# EAGLE schematic core (EAGLE 7.1.0)
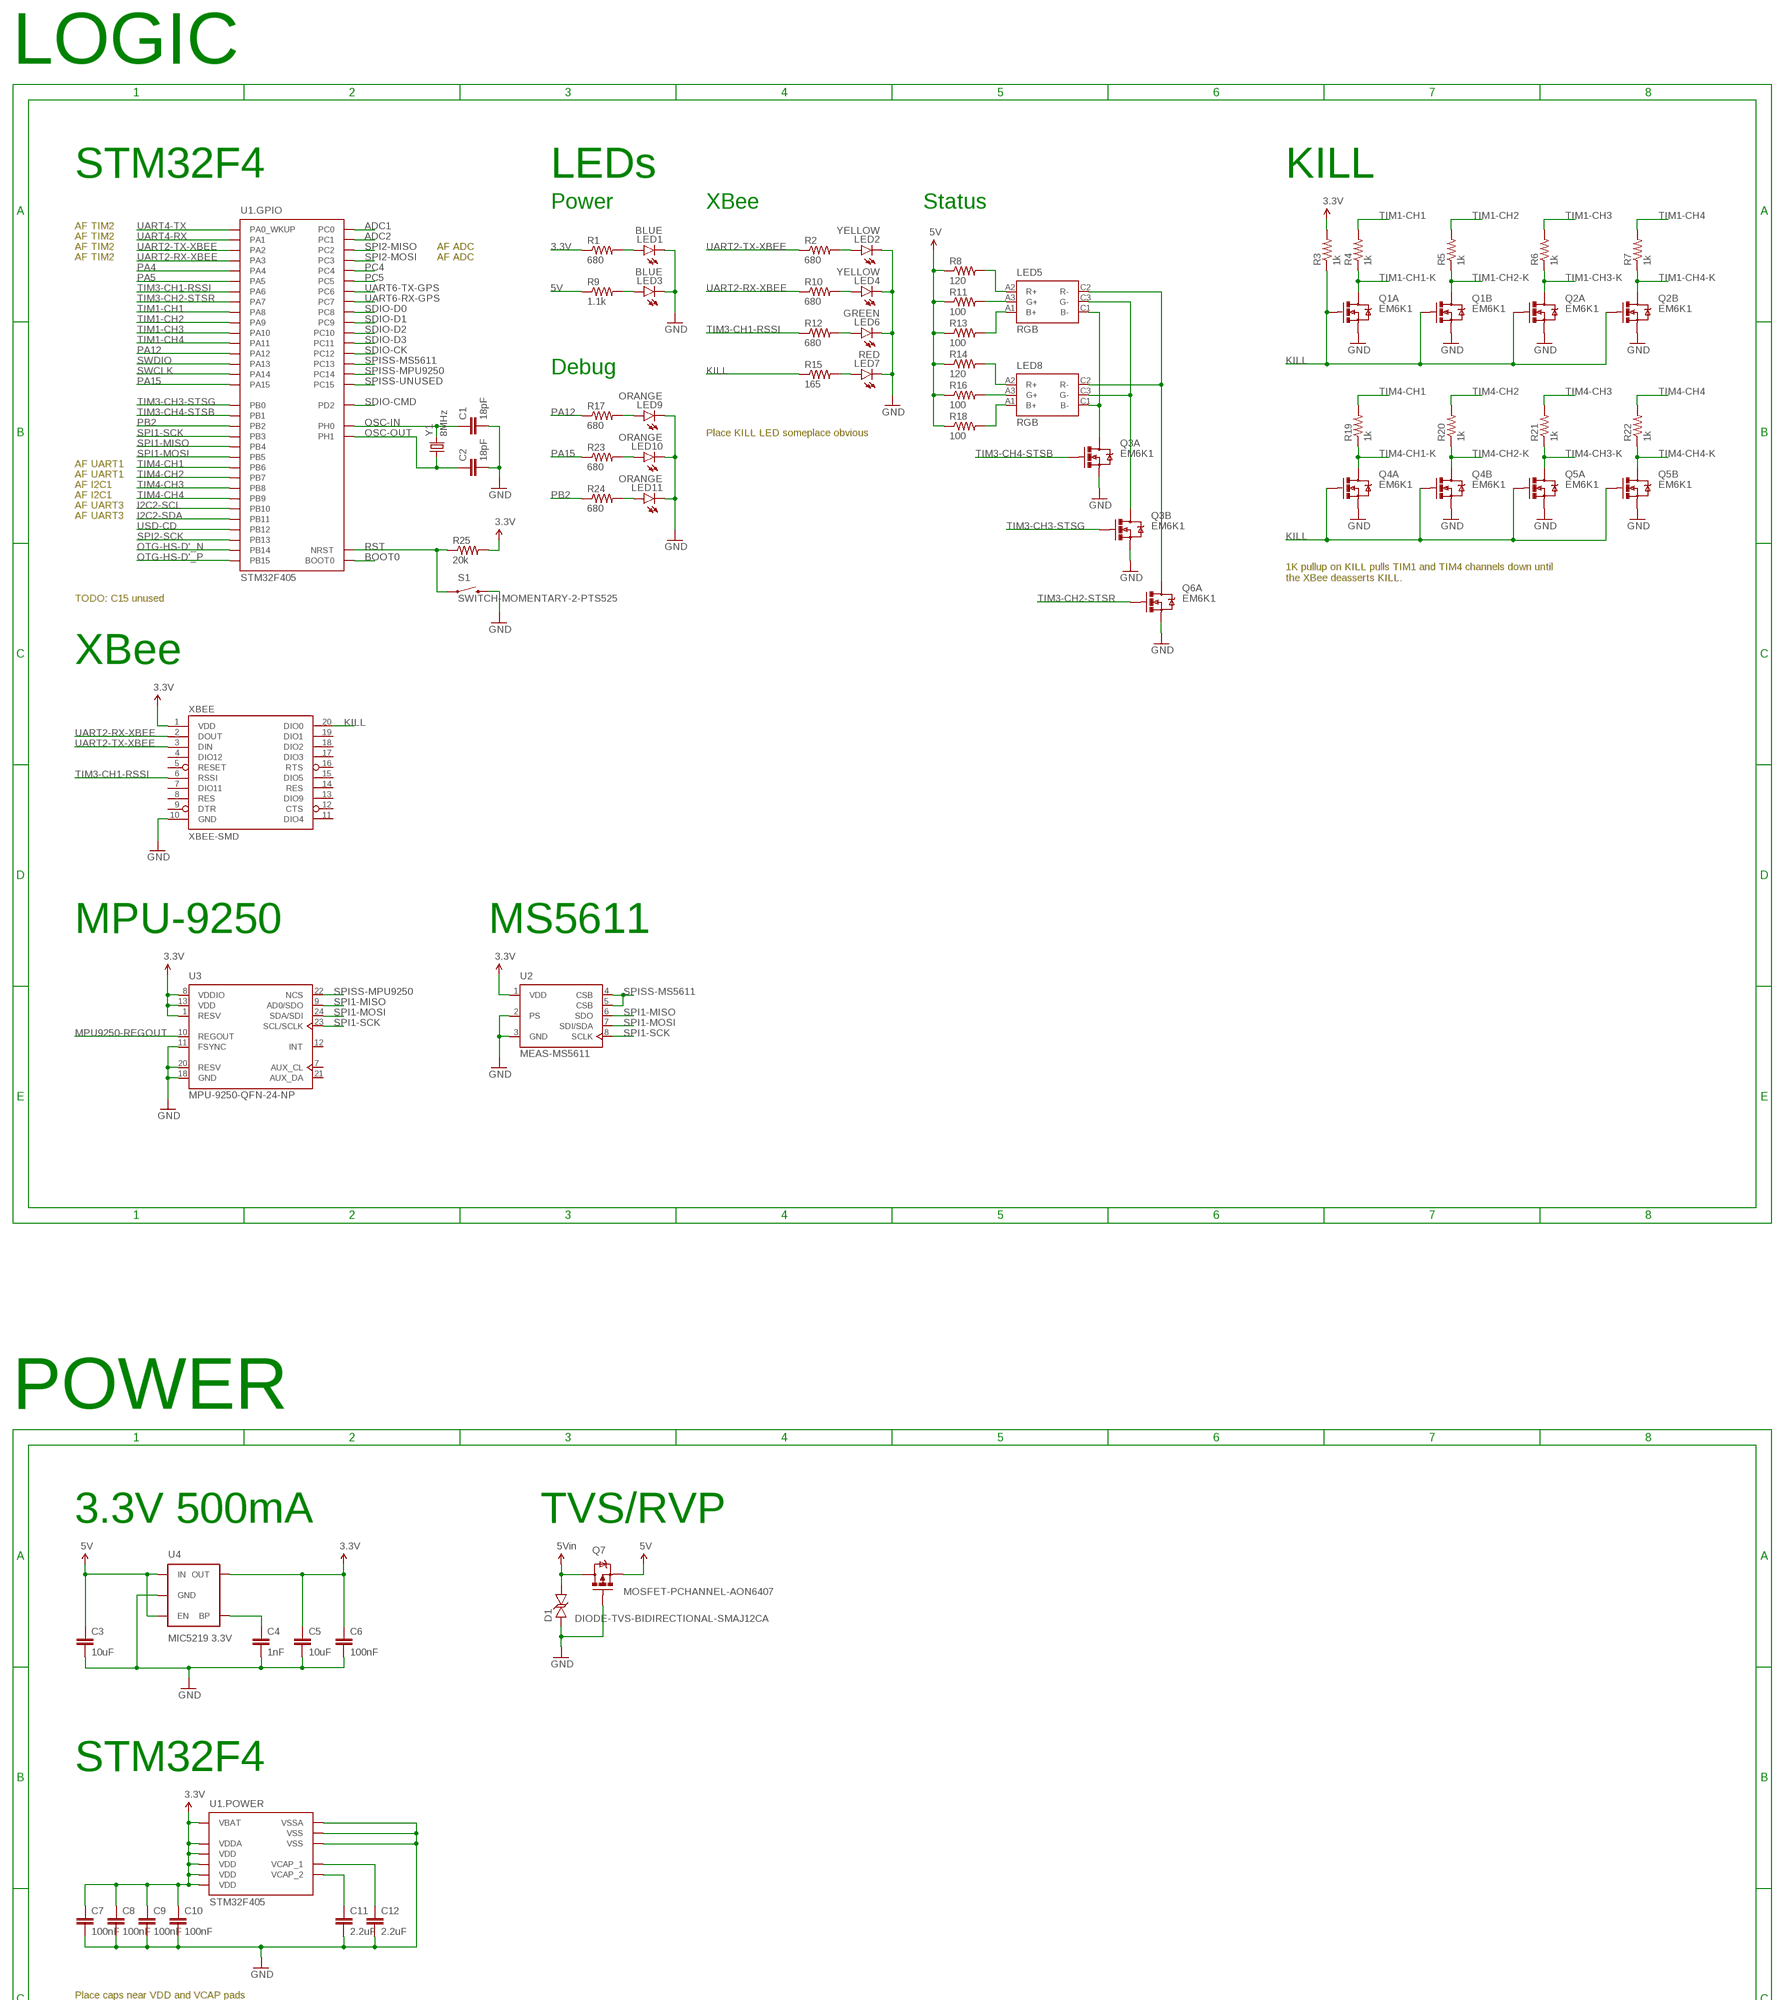
[diagram p0: schematic, sheet 1, part 1 of 2]
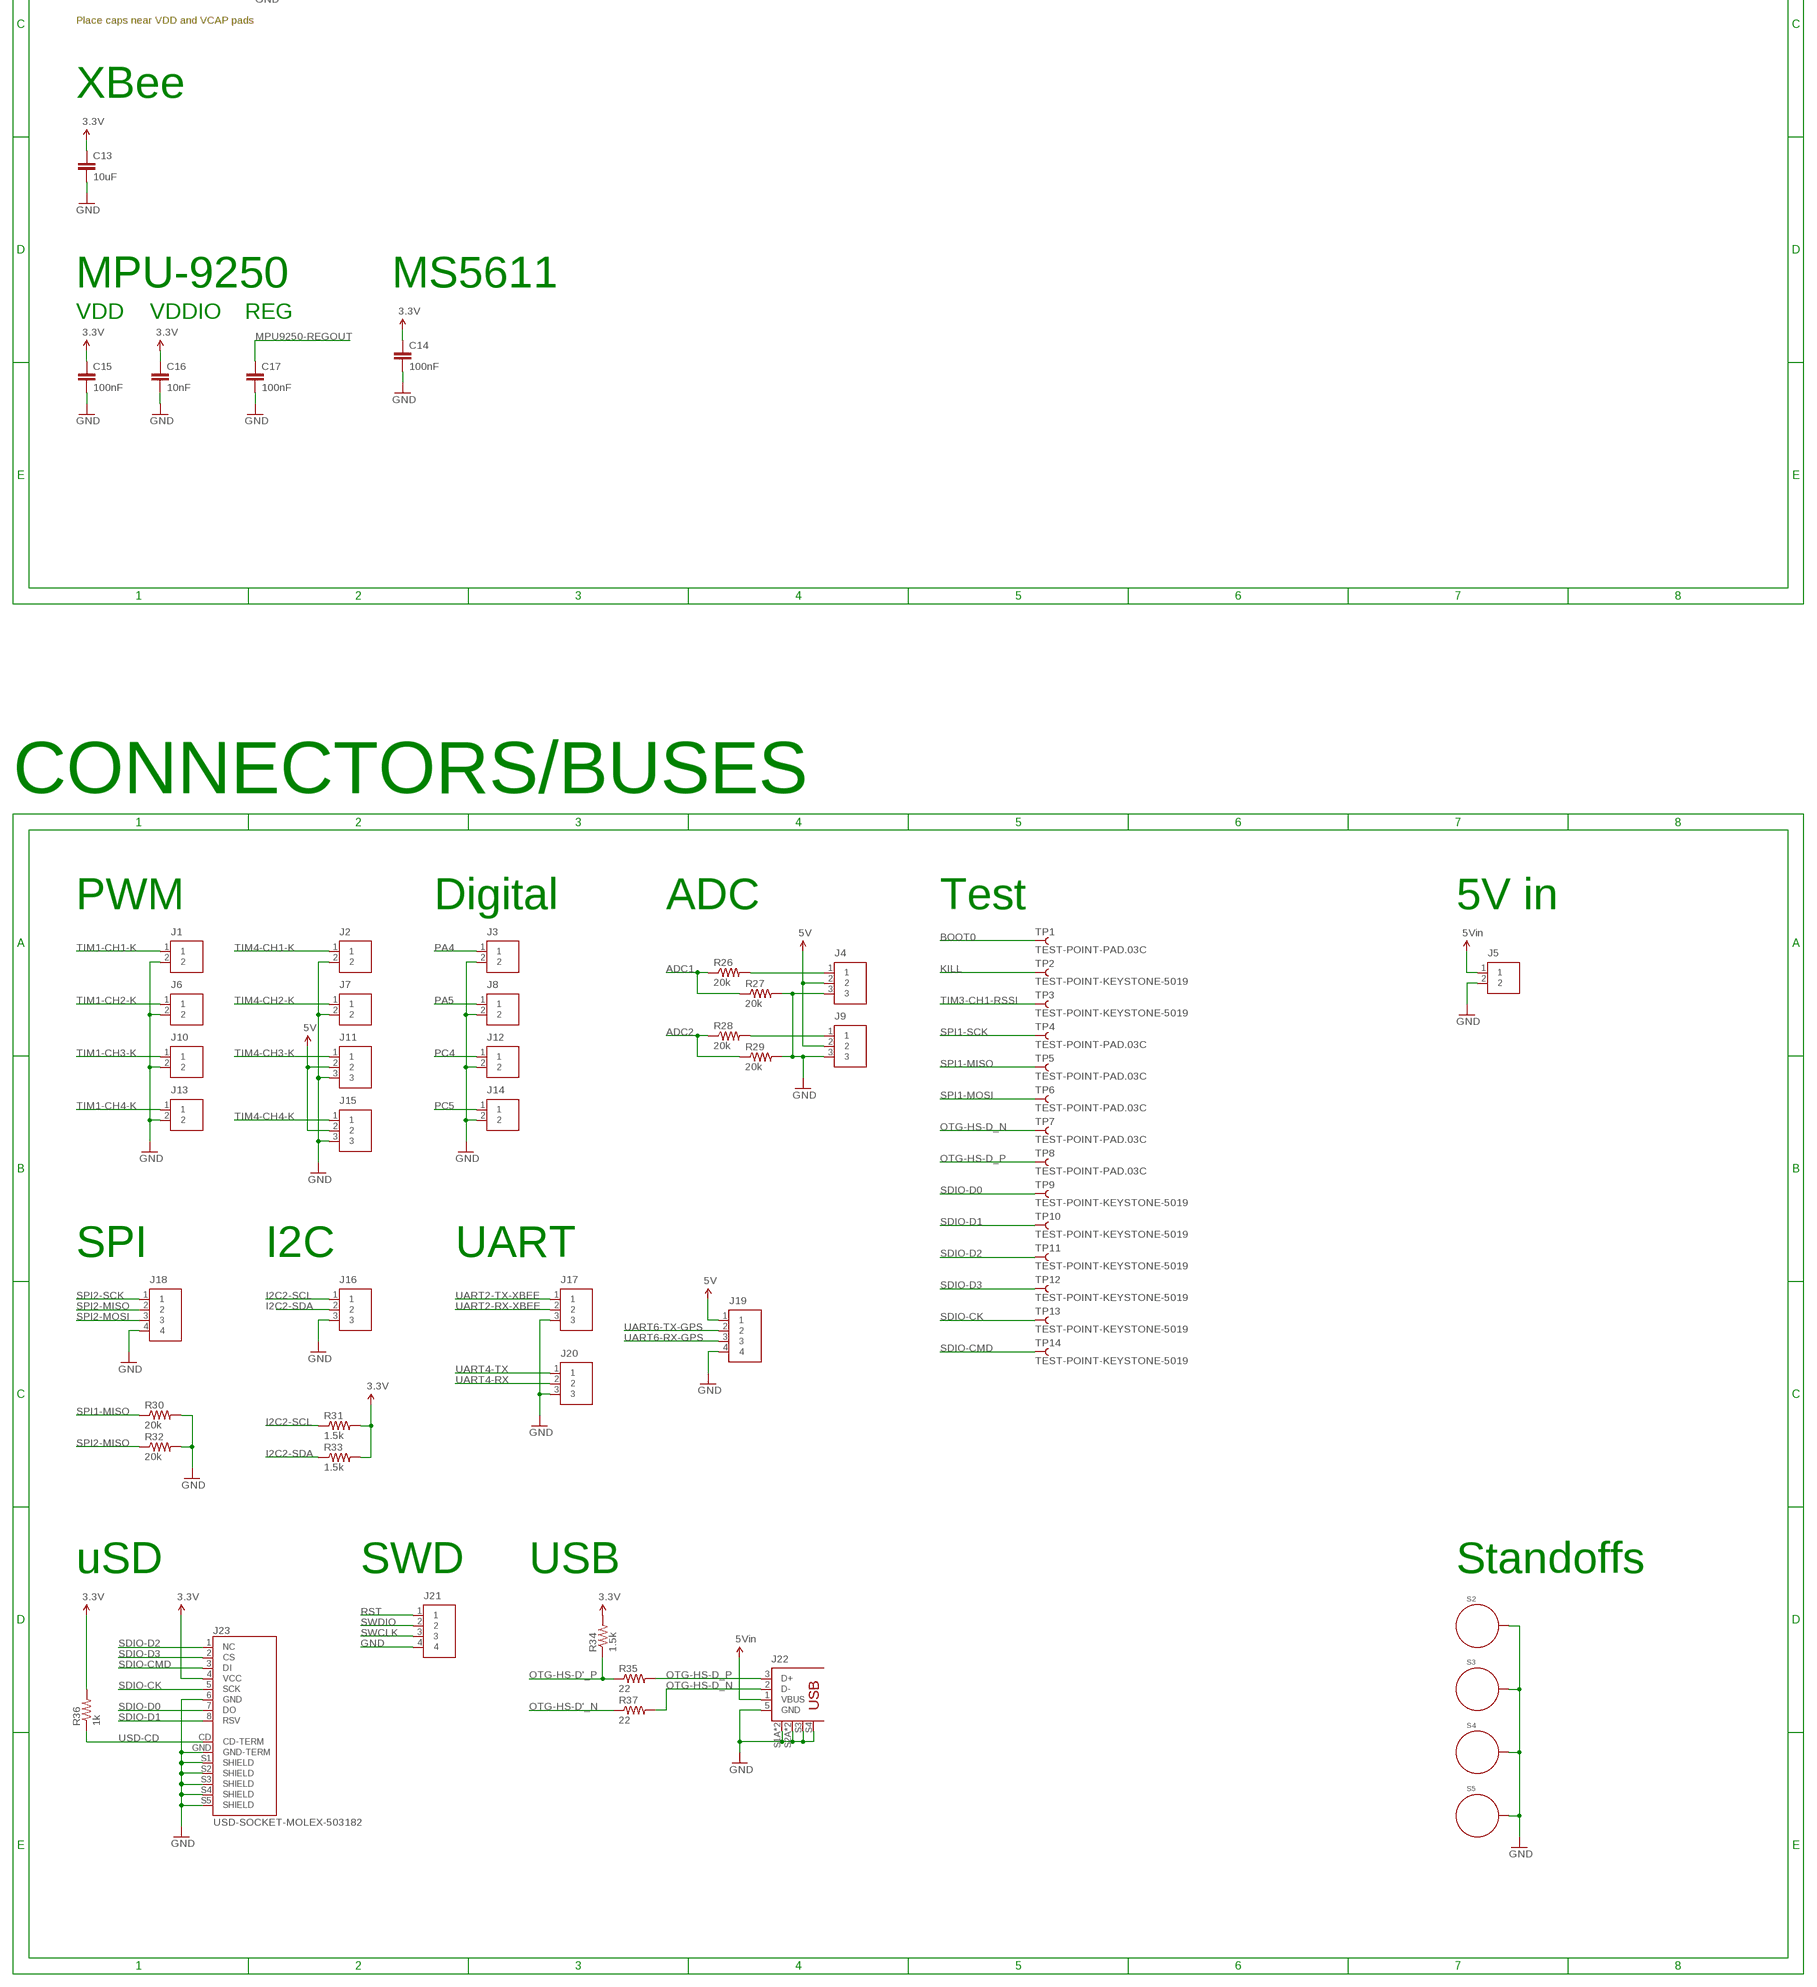
[diagram p1: schematic, sheet 1, part 2 of 2]

## Parts
C1  18pF  CAP-18PF-50V-5%(0603)  [0603]
C2  18pF  CAP-18PF-50V-5%(0603)  [0603]
C3  10uF  CAP-10UF-10V-10%(0805)  [0805]
C4  1nF  CAP-1NF-50V-10%(0603)  [0603]
C5  10uF  CAP-10UF-10V-10%(0805)  [0805]
C6  100nF  CAP-100NF-16V-10%(0603)  [0603]
C7  100nF  CAP-100NF-16V-10%(0603)  [0603]
C8  100nF  CAP-100NF-16V-10%(0603)  [0603]
C9  100nF  CAP-100NF-16V-10%(0603)  [0603]
C10  100nF  CAP-100NF-16V-10%(0603)  [0603]
C11  2.2uF  CAP-2.2UF-10V-10%(0603)  [0603]
C12  2.2uF  CAP-2.2UF-10V-10%(0603)  [0603]
C13  10uF  CAP-10UF-10V-10%(0805)  [0805]
C14  100nF  CAP-100NF-16V-10%(0603)  [0603]
C15  100nF  CAP-100NF-16V-10%(0603)  [0603]
C16  10nF  CAP-10NF-50V-10%(0603)  [0603]
C17  100nF  CAP-100NF-16V-10%(0603)  [0603]
D1  DIODE-TVS-BIDIRECTIONAL-SMAJ12CA  [SMAJ]
J1  M02  [MOLEX-2MM-MICROLATCH-2POS-RA]
J2  M02  [MOLEX-2MM-MICROLATCH-2POS-RA]
J3  M02  [MOLEX-2MM-MICROLATCH-2POS-RA]
J4  M03  [MOLEX-2MM-MICROLATCH-3POS-RA]
J5  M02  [MOLEX-2MM-MICROLATCH-2POS-RA]
J6  M02  [MOLEX-2MM-MICROLATCH-2POS-RA]
J7  M02  [MOLEX-2MM-MICROLATCH-2POS-RA]
J8  M02  [MOLEX-2MM-MICROLATCH-2POS-RA]
J9  M03  [MOLEX-2MM-MICROLATCH-3POS-RA]
J10  M02  [MOLEX-2MM-MICROLATCH-2POS-RA]
J11  M03  [MOLEX-2MM-MICROLATCH-3POS-RA]
J12  M02  [MOLEX-2MM-MICROLATCH-2POS-RA]
J13  M02  [MOLEX-2MM-MICROLATCH-2POS-RA]
J14  M02  [MOLEX-2MM-MICROLATCH-2POS-RA]
J15  M03  [MOLEX-2MM-MICROLATCH-3POS-RA]
J16  M03  [MOLEX-2MM-MICROLATCH-3POS-RA]
J17  M03  [MOLEX-2MM-MICROLATCH-3POS-RA]
J18  M04  [MOLEX-2MM-MICROLATCH-4POS-RA]
J19  M04  [MOLEX-2MM-MICROLATCH-4POS-RA]
J20  M03  [MOLEX-2MM-MICROLATCH-3POS-RA]
J21  M04  [MOLEX-2MM-MICROLATCH-4POS-RA]
J22  USB+SHIELD-MICROB-SMD-MOLEX  [USB-MICROB-SMD-MOLEX]
J23  USD-SOCKET-MOLEX-503182  [USD-SOCKET-PP-MOLEX-503182]
LED1  BLUE  LED-KINGBRIGHT-HELI-BLUE(0603)  [LED-0603]
LED2  YELLOW  LED-KINGBRIGHT-HELI-YELLOW(0603)  [LED-0603]
LED3  BLUE  LED-KINGBRIGHT-HELI-BLUE(0603)  [LED-0603]
LED4  YELLOW  LED-KINGBRIGHT-HELI-YELLOW(0603)  [LED-0603]
LED5  RGB  OSRAM-MULTILED-RGB  [PLCC-6]
LED6  GREEN  LED-KINGBRIGHT-HELI-GREEN(0603)  [LED-0603]
LED7  RED  LED-KINGBRIGHT-HELI-RED(0603)  [LED-0603]
LED8  RGB  OSRAM-MULTILED-RGB  [PLCC-6]
LED9  ORANGE  LED-KINGBRIGHT-HELI-ORANGE(0603)  [LED-0603]
LED10  ORANGE  LED-KINGBRIGHT-HELI-ORANGE(0603)  [LED-0603]
LED11  ORANGE  LED-KINGBRIGHT-HELI-ORANGE(0603)  [LED-0603]
Q1  EM6K1  MOSFET-NCHANNEL-DUAL-EM6K1  [SOT-666]
Q2  EM6K1  MOSFET-NCHANNEL-DUAL-EM6K1  [SOT-666]
Q3  EM6K1  MOSFET-NCHANNEL-DUAL-EM6K1  [SOT-666]
Q4  EM6K1  MOSFET-NCHANNEL-DUAL-EM6K1  [SOT-666]
Q5  EM6K1  MOSFET-NCHANNEL-DUAL-EM6K1  [SOT-666]
Q6  EM6K1  MOSFET-NCHANNEL-DUAL-EM6K1  [SOT-666]
Q7  MOSFET-PCHANNEL-AON6407  [DFN5X6]
R1  680  RES-680OHM-0.1W-5%(0603)  [0603]
R2  680  RES-680OHM-0.1W-5%(0603)  [0603]
R3  1k  RES-1KOHM-0.1W-5%(0603)  [0603]
R4  1k  RES-1KOHM-0.1W-5%(0603)  [0603]
R5  1k  RES-1KOHM-0.1W-5%(0603)  [0603]
R6  1k  RES-1KOHM-0.1W-5%(0603)  [0603]
R7  1k  RES-1KOHM-0.1W-5%(0603)  [0603]
R8  120  RES-120OHM-0.1W-5%(0603)  [0603]
R9  1.1k  RES-1.1KOHM-0.1W-5%(0603)  [0603]
R10  680  RES-680OHM-0.1W-5%(0603)  [0603]
R11  100  RES-100OHM-0.1W-5%(0603)  [0603]
R12  680  RES-680OHM-0.1W-5%(0603)  [0603]
R13  100  RES-100OHM-0.1W-5%(0603)  [0603]
R14  120  RES-120OHM-0.1W-5%(0603)  [0603]
R15  165  RES-165OHM-0.1W-1%(0603)  [0603]
R16  100  RES-100OHM-0.1W-5%(0603)  [0603]
R17  680  RES-680OHM-0.1W-5%(0603)  [0603]
R18  100  RES-100OHM-0.1W-5%(0603)  [0603]
R19  1k  RES-1KOHM-0.1W-5%(0603)  [0603]
R20  1k  RES-1KOHM-0.1W-5%(0603)  [0603]
R21  1k  RES-1KOHM-0.1W-5%(0603)  [0603]
R22  1k  RES-1KOHM-0.1W-5%(0603)  [0603]
R23  680  RES-680OHM-0.1W-5%(0603)  [0603]
R24  680  RES-680OHM-0.1W-5%(0603)  [0603]
R25  20k  RES-20KOHM-0.1W-1%(0603)  [0603]
R26  20k  RES-20KOHM-0.1W-0.1%(0603)  [0603]
R27  20k  RES-20KOHM-0.1W-0.1%(0603)  [0603]
R28  20k  RES-20KOHM-0.1W-0.1%(0603)  [0603]
R29  20k  RES-20KOHM-0.1W-0.1%(0603)  [0603]
R30  20k  RES-20KOHM-0.1W-1%(0603)  [0603]
R31  1.5k  RES-1.5KOHM-0.1W-5%(0603)  [0603]
R32  20k  RES-20KOHM-0.1W-1%(0603)  [0603]
R33  1.5k  RES-1.5KOHM-0.1W-5%(0603)  [0603]
R34  1.5k  RES-1.5KOHM-0.1W-5%(0603)  [0603]
R35  22  RES-22OHM-0.1W-5%(0603)  [0603]
R36  1k  RES-1KOHM-0.1W-5%(0603)  [0603]
R37  22  RES-22OHM-0.1W-5%(0603)  [0603]
S1  SWITCH-MOMENTARY-2-PTS525  [TACTILE-SWITCH-SMD]
S2  STANDOFF_ELECTRICAL-#4  [STANDOFF-ELECTRICAL-#4]
S3  STANDOFF_ELECTRICAL-#4  [STANDOFF-ELECTRICAL-#4]
S4  STANDOFF_ELECTRICAL-#4  [STANDOFF-ELECTRICAL-#4]
S5  STANDOFF_ELECTRICAL-#4  [STANDOFF-ELECTRICAL-#4]
TP1  TEST-POINT-PAD.03C  [PAD-.03C]
TP2  TEST-POINT-KEYSTONE-5019  [PAD.15X.08]
TP3  TEST-POINT-KEYSTONE-5019  [PAD.15X.08]
TP4  TEST-POINT-PAD.03C  [PAD-.03C]
TP5  TEST-POINT-PAD.03C  [PAD-.03C]
TP6  TEST-POINT-PAD.03C  [PAD-.03C]
TP7  TEST-POINT-PAD.03C  [PAD-.03C]
TP8  TEST-POINT-PAD.03C  [PAD-.03C]
TP9  TEST-POINT-KEYSTONE-5019  [PAD.15X.08]
TP10  TEST-POINT-KEYSTONE-5019  [PAD.15X.08]
TP11  TEST-POINT-KEYSTONE-5019  [PAD.15X.08]
TP12  TEST-POINT-KEYSTONE-5019  [PAD.15X.08]
TP13  TEST-POINT-KEYSTONE-5019  [PAD.15X.08]
TP14  TEST-POINT-KEYSTONE-5019  [PAD.15X.08]
U1  STM32F405  [LQFP-64-STM32F405]
U2  MEAS-MS5611  [MEAS-MS5611]
U3  MPU-9250-QFN-24-NP  [QFN-24-NP-3X3MM]
U4  MIC5219 3.3V  V-REG-MIC5219-3.3V  [SOT23-5]
XBEE  XBEE-SMD  [XBEE-SMD]
Y1  8MHz  CRYSTAL-8MHZ-CX532  [CX532]

## Nets
3.3V: C5.2 C6.2 C7.2 C8.2 C9.2 C10.2 C13.2 C14.2 C15.2 C16.2 J23.4(VCC) R1.1 R3.2 R25.2 R31.2 R33.2 R34.2 R36.2 U1.1(.POWER:VBAT) U1.13(.POWER:VDDA) U1.19(.POWER:VDD) U1.32(.POWER:VDD) U1.48(.POWER:VDD) U1.64(.POWER:VDD) U2.1(VDD) U3.1(RESV) U3.8(VDDIO) U3.13(VDD) U4.5(OUT) XBEE.1(VDD)
5V: C3.2 J4.2 J9.2 J11.2 J15.2 J19.1 Q7.1(S) Q7.2(S) Q7.3(S) R8.1 R9.1 R11.1 R13.1 R14.1 R16.1 R18.1 U4.1(IN) U4.3(EN)
ADC1: R26.1 R27.1 U1.8(.GPIO:PC0)
ADC1-IN: J4.1 R26.2
ADC2: R28.1 R29.1 U1.9(.GPIO:PC1)
ADC2-IN: J9.1 R28.2
BOOT0: TP1.1 U1.60(.GPIO:BOOT0)
F4-VCAP-1: C11.2 U1.47(.POWER:VCAP_2)
F4-VCAP-2: C12.2 U1.31(.POWER:VCAP_1)
GND: C1.1 C2.1 C3.1 C4.1 C5.1 C6.1 C7.1 C8.1 C9.1 C10.1 C11.1 C12.1 C13.1 C14.1 C15.1 C16.1 C17.1 D1.A J1.2 J2.2 J3.2 J4.3 J5.2 J6.2 J7.2 J8.2 J9.3 J10.2 J11.3 J12.2 J13.2 J14.2 J15.3 J16.3 J17.3 J18.4 J19.4 J20.3 J21.4 J22.5(GND) J22.S1A(S1) J22.S1B(S1) J22.S2A(S2) J22.S2B(S2) J22.S3 J22.S4 J23.6(GND) J23.GND(GND-TERM) J23.S1(SHIELD) J23.S2(SHIELD) J23.S3(SHIELD) J23.S4(SHIELD) J23.S5(SHIELD) LED1.C LED2.C LED3.C LED4.C LED6.C LED7.C LED9.C LED10.C LED11.C Q1.1(A:S) Q1.4(B:S) Q2.1(A:S) Q2.4(B:S) Q3.1(A:S) Q3.4(B:S) Q4.1(A:S) Q4.4(B:S) Q5.1(A:S) Q5.4(B:S) Q6.1(A:S) Q7.4(G) R27.2 R29.2 R30.2 R32.2 S1.3 S1.4 S2.P1 S3.P1 S4.P1 S5.P1 U1.12(.POWER:VSSA) U1.18(.POWER:VSS) U1.63(.POWER:VSS) U2.2(PS) U2.3(GND) U3.11(FSYNC) U3.18(GND) U3.20(RESV) U4.2(GND) XBEE.10(GND)
I2C2-SCL: J16.1 R31.1 U1.29(.GPIO:PB10)
I2C2-SDA: J16.2 R33.1 U1.30(.GPIO:PB11)
KILL: Q1.2(A:G) Q1.5(B:G) Q2.2(A:G) Q2.5(B:G) Q4.2(A:G) Q4.5(B:G) Q5.2(A:G) Q5.5(B:G) R3.1 R15.1 TP2.1 XBEE.20(DIO0)
MIC-BP: C4.2 U4.4(BP)
MPU9250-REGOUT: C17.2 U3.10(REGOUT)
N$2: LED9.A R17.2
N$3: LED10.A R23.2
N$4: LED11.A R24.2
N$34: LED6.A R12.2
N$35: LED7.A R15.2
N$36: LED2.A R2.2
N$37: LED4.A R10.2
N$38: LED1.A R1.2
N$39: LED3.A R9.2
OSC-IN: C1.2 U1.5(.GPIO:PH0) Y1.2
OSC-OUT: C2.2 U1.6(.GPIO:PH1) Y1.1
OTG-HS-D'_N [USB]: R37.1 U1.35(.GPIO:PB14)
OTG-HS-D'_P [USB]: R34.1 R35.1 U1.36(.GPIO:PB15)
OTG-HS-D_N [USB]: J22.2(D-) R37.2 TP7.1
OTG-HS-D_P [USB]: J22.3(D+) R35.2 TP8.1
PA4: J3.1 U1.20(.GPIO:PA4)
PA5: J8.1 U1.21(.GPIO:PA5)
PA12: R17.1 U1.45(.GPIO:PA12)
PA15: R23.1 U1.50(.GPIO:PA15)
PB2: R24.1 U1.28(.GPIO:PB2)
PC4: J12.1 U1.24(.GPIO:PC4)
PC5: J14.1 U1.25(.GPIO:PC5)
RST: J21.1 R25.1 S1.1 S1.2 U1.7(.GPIO:NRST)
SDIO-CK: J23.5(SCK) TP13.1 U1.53(.GPIO:PC12)
SDIO-CMD: J23.3(DI) TP14.1 U1.54(.GPIO:PD2)
SDIO-D0: J23.7(DO) TP9.1 U1.39(.GPIO:PC8)
SDIO-D1: J23.8(RSV) TP10.1 U1.40(.GPIO:PC9)
SDIO-D2: J23.1(NC) TP11.1 U1.51(.GPIO:PC10)
SDIO-D3: J23.2(CS) TP12.1 U1.52(.GPIO:PC11)
SPI1-MISO: R30.1 TP5.1 U1.56(.GPIO:PB4) U2.6(SDO) U3.9(AD0/SDO)
SPI1-MOSI: TP6.1 U1.57(.GPIO:PB5) U2.7(SDI/SDA) U3.24(SDA/SDI)
SPI1-SCK: TP4.1 U1.55(.GPIO:PB3) U2.8(SCLK) U3.23(SCL/SCLK)
SPI2-MISO: J18.2 R32.1 U1.10(.GPIO:PC2)
SPI2-MOSI: J18.3 U1.11(.GPIO:PC3)
SPI2-SCK: J18.1 U1.34(.GPIO:PB13)
SPISS-MPU9250: U1.3(.GPIO:PC14) U3.22(NCS)
SPISS-MS5611: U1.2(.GPIO:PC13) U2.4(CSB) U2.5(CSB)
SPISS-UNUSED: U1.4(.GPIO:PC15)
STSB1+: LED5.A1(B+) R13.2
STSB2+: LED8.A1(B+) R18.2
STSB-: LED5.C1(B-) LED8.C1(B-) Q3.6(A:D)
STSG1+: LED5.A3(G+) R11.2
STSG2+: LED8.A3(G+) R16.2
STSG-: LED5.C3(G-) LED8.C3(G-) Q3.3(B:D)
STSR1+: LED5.A2(R+) R8.2
STSR2+: LED8.A2(R+) R14.2
STSR-: LED5.C2(R-) LED8.C2(R-) Q6.6(A:D)
SWCLK: J21.3 U1.49(.GPIO:PA14)
SWDIO: J21.2 U1.46(.GPIO:PA13)
TIM1-CH1: R4.2 U1.41(.GPIO:PA8)
TIM1-CH1-K: J1.1 Q1.6(A:D) R4.1
TIM1-CH2: R5.2 U1.42(.GPIO:PA9)
TIM1-CH2-K: J6.1 Q1.3(B:D) R5.1
TIM1-CH3: R6.2 U1.43(.GPIO:PA10)
TIM1-CH3-K: J10.1 Q2.6(A:D) R6.1
TIM1-CH4: R7.2 U1.44(.GPIO:PA11)
TIM1-CH4-K: J13.1 Q2.3(B:D) R7.1
TIM3-CH1-RSSI: R12.1 TP3.1 U1.22(.GPIO:PA6) XBEE.6(RSSI)
TIM3-CH2-STSR: Q6.2(A:G) U1.23(.GPIO:PA7)
TIM3-CH3-STSG: Q3.5(B:G) U1.26(.GPIO:PB0)
TIM3-CH4-STSB: Q3.2(A:G) U1.27(.GPIO:PB1)
TIM4-CH1: R19.2 U1.58(.GPIO:PB6)
TIM4-CH1-K: J2.1 Q4.6(A:D) R19.1
TIM4-CH2: R20.2 U1.59(.GPIO:PB7)
TIM4-CH2-K: J7.1 Q4.3(B:D) R20.1
TIM4-CH3: R21.2 U1.61(.GPIO:PB8)
TIM4-CH3-K: J11.1 Q5.6(A:D) R21.1
TIM4-CH4: R22.2 U1.62(.GPIO:PB9)
TIM4-CH4-K: J15.1 Q5.3(B:D) R22.1
UART2-RX-XBEE: J17.2 R10.1 U1.17(.GPIO:PA3) XBEE.2(DOUT)
UART2-TX-XBEE: J17.1 R2.1 U1.16(.GPIO:PA2) XBEE.3(DIN)
UART4-RX: J20.2 U1.15(.GPIO:PA1)
UART4-TX: J20.1 U1.14(.GPIO:PA0_WKUP)
UART6-RX-GPS: J19.3 U1.38(.GPIO:PC7)
UART6-TX-GPS: J19.2 U1.37(.GPIO:PC6)
USD-CD: J23.CD(CD-TERM) R36.1 U1.33(.GPIO:PB12)
VIN: D1.C J5.1 J22.1(VBUS) Q7.5(D) Q7.6(D) Q7.7(D) Q7.8(D) Q7.9(D) Q7.10(D) ; supply symbol labelled 5Vin
Unconnected: Q6.3(B:D) Q6.4(B:S) Q6.5(B:G) U3.7(AUX_CL) U3.12(INT) U3.21(AUX_DA) XBEE.4(DIO12) XBEE.5(RESET) XBEE.7(DIO11) XBEE.8(RES) XBEE.9(DTR) XBEE.11(DIO4) XBEE.12(CTS) XBEE.13(DIO9) XBEE.14(RES) XBEE.15(DIO5) XBEE.16(RTS) XBEE.17(DIO3) XBEE.18(DIO2) XBEE.19(DIO1)

## Notes on the sheet
- LOGIC
- STM32F4 | LEDs | KILL
- Power | XBee | Status
- AF TIM2
- AF TIM2
- AF TIM2 | AF ADC
- AF TIM2 | AF ADC
- Debug
- Place KILL LED someplace obvious
- AF UART1
- AF UART1
- AF I2C1
- AF I2C1
- AF UART3
- AF UART3
- 1K pullup on KILL pulls TIM1 and TIM4 channels down until 
  the XBee deasserts KILL.
- TODO: C15 unused
- XBee
- MPU-9250 | MS5611
- POWER
- 3.3V 500mA | TVS/RVP
- STM32F4
- Place caps near VDD and VCAP pads
- XBee
- MPU-9250 | MS5611
- VDD | VDDIO | REG
- CONNECTORS/BUSES
- PWM | Digital | ADC | Test | 5V in
- SPI | I2C | UART
- uSD | SWD | USB | Standoffs

## Library data of the parts
C1 C2 = OSURC_Passives:CAP; DIGIKEY_PN: 490-1409-1-ND
C3 C5 C13 = OSURC_Passives:CAP; DIGIKEY_PN: 490-1709-1-ND
C4 = OSURC_Passives:CAP; DIGIKEY_PN: 490-1494-1-ND
C6-C10 C14 C15 C17 = OSURC_Passives:CAP; DIGIKEY_PN: 490-1532-1-ND
C11 C12 = OSURC_Passives:CAP; DIGIKEY_PN: 490-1545-1-ND
C16 = OSURC_Passives:CAP; DIGIKEY_PN: 490-1512-1-ND
D1 = OSURC_DiscreteSemi:DIODE-TVS-BIDIRECTIONAL: Generic bidirectional TVS diode.; DIGIKEY_PN: SMAJ12CABCT-ND
J1-J3 J5-J8 J10 J12-J14 = OSURC_Connectors:M02; DIGIKEY_PN: WM18999-ND
J4 J9 J11 J15-J17 J20 = OSURC_Connectors:M03; DIGIKEY_PN: WM19000-ND
J18 J19 J21 = OSURC_Connectors:M04; DIGIKEY_PN: WM19001-ND
J22 = OSURC_Connectors:USB+SHIELD: USB+Shield USB connector with shield pins connectable; DIGIKEY_PN: WM17141CT-ND
J23 = OSURC_Connectors:USD-SOCKET: Molex microSD socket Push-push type uSD socket. tDoc lines correctly indicate media card edge positions when inserting (unlocked, locked, depressed).; DIGIKEY_PN: WM9750CT-ND
LED1 LED3 = OSURC_LED:LED-KINGBRIGHT-HELI: Kingbright HELI series LEDs. 0603 package, hella bright.; DIGIKEY_PN: 754-1789-1-ND
LED2 LED4 = OSURC_LED:LED-KINGBRIGHT-HELI: Kingbright HELI series LEDs. 0603 package, hella bright.; DIGIKEY_PN: 754-1788-1-ND
LED5 LED8 = OSURC_LED:OSRAM-MULTILED-RGB: Compact, blindingly bright RGB LED.; DIGIKEY_PN: 475-2899-1-ND
LED6 = OSURC_LED:LED-KINGBRIGHT-HELI: Kingbright HELI series LEDs. 0603 package, hella bright.; DIGIKEY_PN: 754-1790-1-ND
LED7 = OSURC_LED:LED-KINGBRIGHT-HELI: Kingbright HELI series LEDs. 0603 package, hella bright.; DIGIKEY_PN: 754-1786-1-ND
LED9-LED11 = OSURC_LED:LED-KINGBRIGHT-HELI: Kingbright HELI series LEDs. 0603 package, hella bright.; DIGIKEY_PN: 754-1787-1-ND
Q1-Q6 = OSURC_DiscreteSemi:MOSFET-NCHANNEL-DUAL: Dual N-Channel 30-V (D-S) MOSFET FDMA1024NZ TRANS-09516 http://www.vishay.com/docs/71053/71053.pdf; DIGIKEY_PN: EM6K1T2RCT-ND
Q7 = OSURC_DiscreteSemi:MOSFET-PCHANNEL: Generic PMOSFET IRLML2244 - TRANS-11153 (SOT-23 -20V -4.3A) (1.Gate 2.Source 3.Drain) FQP27P06 - COM-10349 <http://www.sparkfun.com/products/10349> (TO-220 -60V -27A) (1.Gate 2.Source 3.Drain); DIGIKEY_PN: 785-1421-1-ND
R1 R2 R10 R12 R17 R23 R24 = OSURC_Passives:RES; DIGIKEY_PN: P680GCT-ND
R3-R7 R19-R22 R36 = OSURC_Passives:RES; DIGIKEY_PN: P1.0KGCT-ND
R8 R14 = OSURC_Passives:RES; DIGIKEY_PN: P120GCT-ND
R9 = OSURC_Passives:RES; DIGIKEY_PN: P1.1KGCT-ND
R11 R13 R16 R18 = OSURC_Passives:RES; DIGIKEY_PN: P100GCT-ND
R15 = OSURC_Passives:RES; DIGIKEY_PN: P165HCT-ND
R25 R30 R32 = OSURC_Passives:RES; DIGIKEY_PN: P20.0KHCT-ND
R26-R29 = OSURC_Passives:RES; DIGIKEY_PN: P20KDBCT-ND
R31 R33 R34 = OSURC_Passives:RES; DIGIKEY_PN: P1.5KGCT-ND
R35 R37 = OSURC_Passives:RES; DIGIKEY_PN: P22GCT-ND
S1 = OSURC_Electromechanical:SWITCH-MOMENTARY-2: Various NO switches- pushbuttons, reed, etc; DIGIKEY_PN: CKN9104CT-ND
S2-S5 = OSURC_Electromechanical:STANDOFF_ELECTRICAL: A standoff intended to be an electrically connected point. Pad size and stop size allow for a #4 Phillips pan screw head to make a solid connection to the board.
TP1 TP4-TP8 = OSURC_Passives:TEST-POINT: Test points
TP2 TP3 TP9-TP14 = OSURC_Passives:TEST-POINT: Test points; DIGIKEY_PN: 5019KCT-ND
U1 = OSURC_DigitalIC:STM32F405: Fast little Cortex-M4 ARM used by everyone jumping on the custom flight control bandwagon.; DIGIKEY_PN: 497-11767-ND
U2 = OSURC_Sensors:MEAS-MS5611: Fast, accurate barometer.; CDI_PN: MS561101BA03-50
U3 = OSURC_Sensors:MPU-9250: 9DOF (3mag, 3accel, 3gyro). SPI/I2C interface.; CDI_PN: MPU-9250
U4 = OSURC_PowerIC:V-REG-MIC5219: V_REG MIC5219 Standard 3.3V and 5V 500mA LDO voltage regulator in SOT-23 layout. Micrel part MIC5219. BP (by-pass) pin is used to lower output noise with 470pF cap, may be left open.; DIGIKEY_PN: 576-1281-1-ND
XBEE = OSURC_RF:XBEE: Xbee module footprints; DIGIKEY_PN: S5902-10-ND
Y1 = OSURC_FreqCtrl:CRYSTAL: Various standard crystals. Proven footprints.; DIGIKEY_PN: 370-1169-1-ND

## Net classes
1 USB: width 0.61 mm